# EAGLE schematic power_tower_mast (EAGLE 7.1.0)
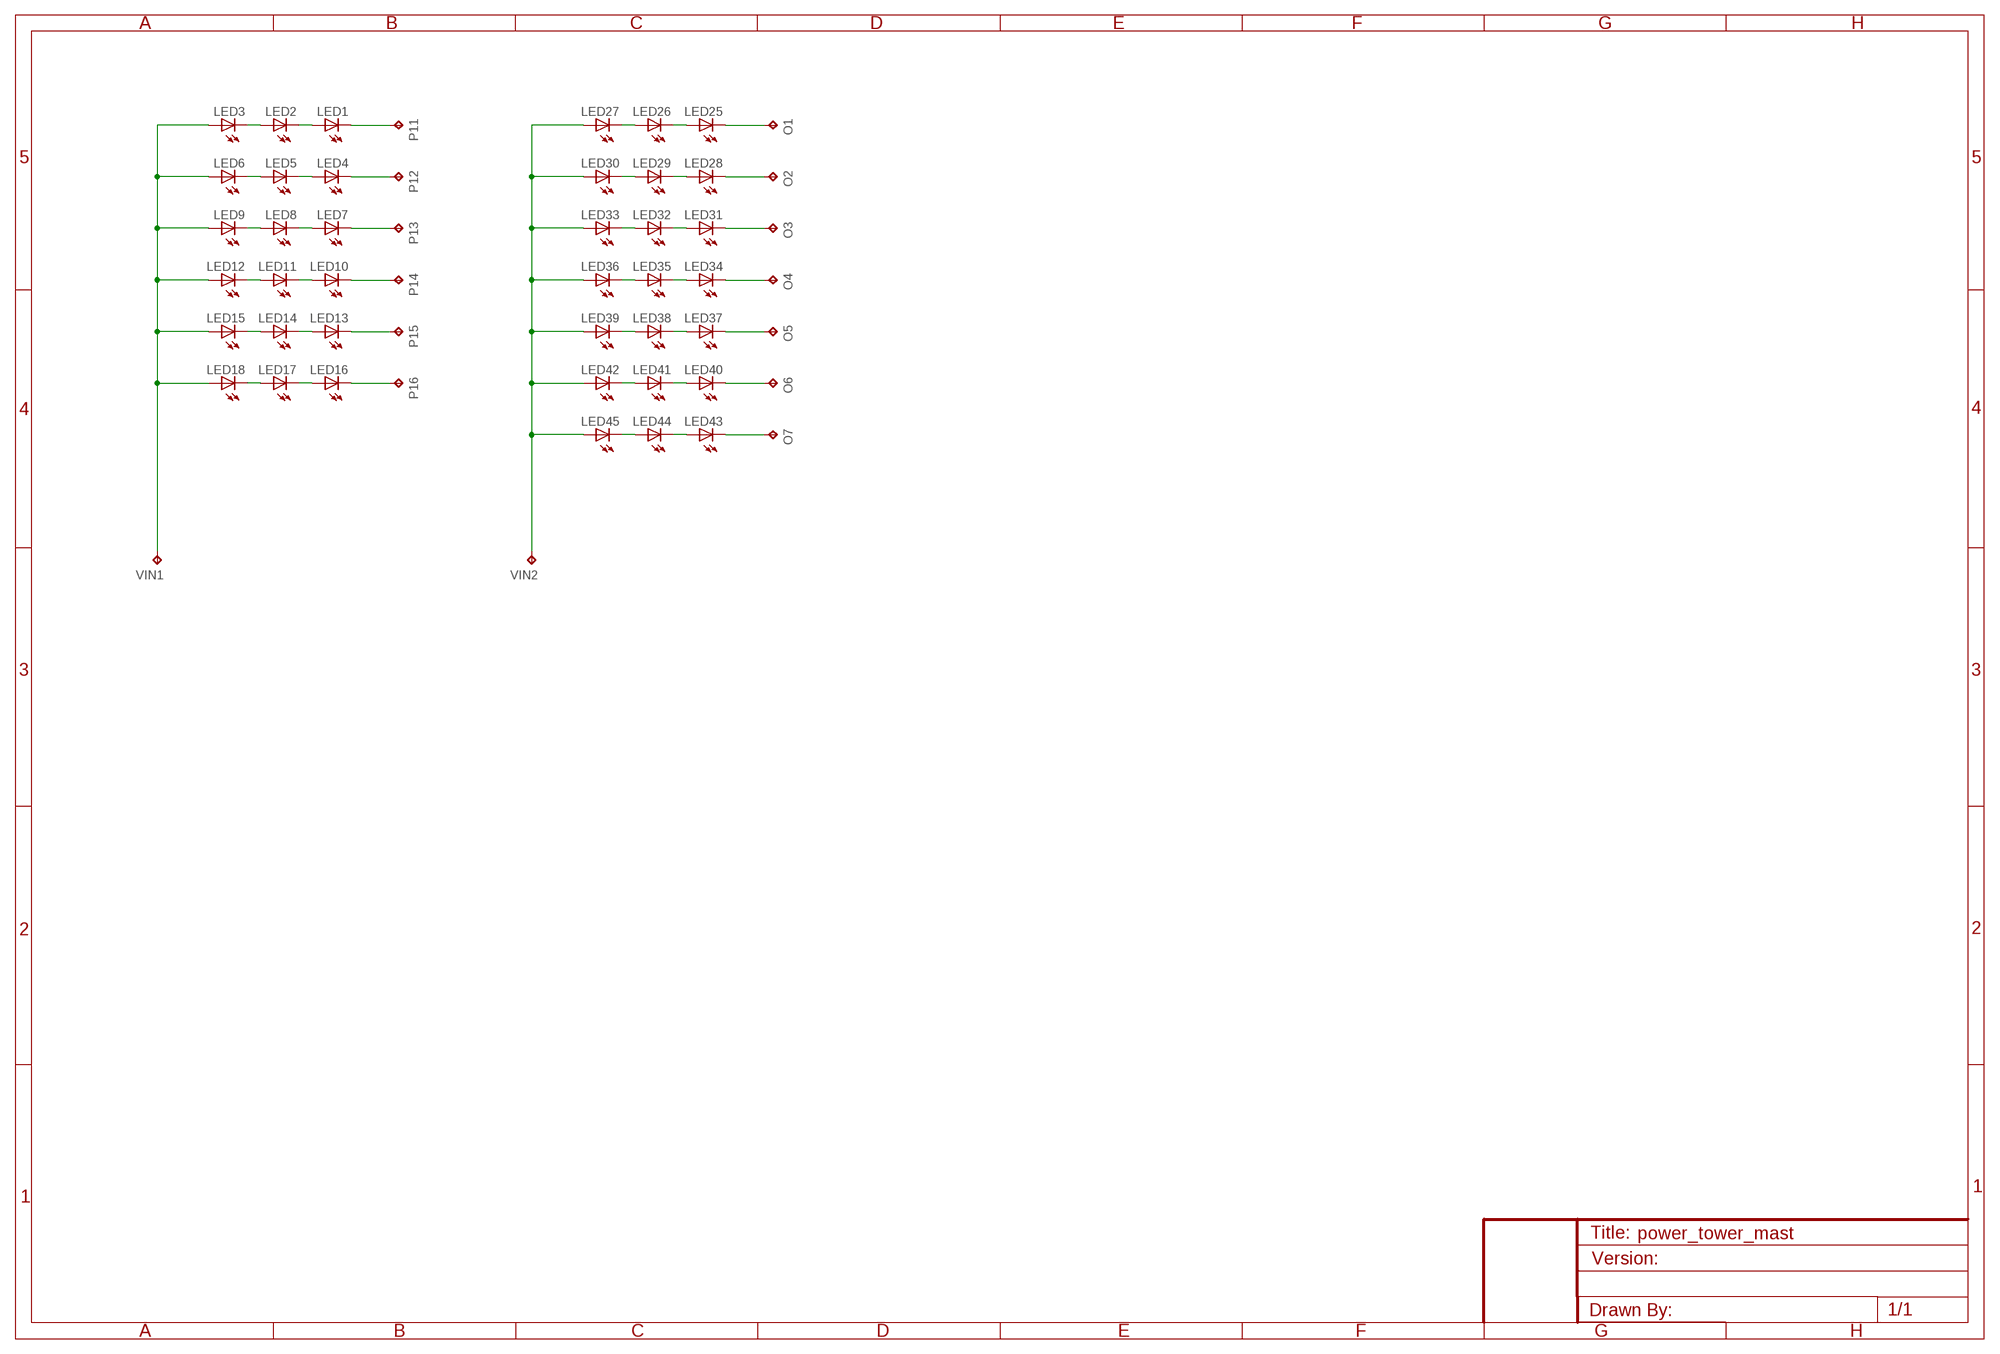
[diagram p0: schematic, sheet 1]

## Parts
LED1  LED0805  [LED_0805]
LED2  LED0805  [LED_0805]
LED3  LED0805  [LED_0805]
LED4  LED0805  [LED_0805]
LED5  LED0805  [LED_0805]
LED6  LED0805  [LED_0805]
LED7  LED0805  [LED_0805]
LED8  LED0805  [LED_0805]
LED9  LED0805  [LED_0805]
LED10  LED0805  [LED_0805]
LED11  LED0805  [LED_0805]
LED12  LED0805  [LED_0805]
LED13  LED0805  [LED_0805]
LED14  LED0805  [LED_0805]
LED15  LED0805  [LED_0805]
LED16  LED0805  [LED_0805]
LED17  LED0805  [LED_0805]
LED18  LED0805  [LED_0805]
LED25  LED0805  [LED_0805]
LED26  LED0805  [LED_0805]
LED27  LED0805  [LED_0805]
LED28  LED0805  [LED_0805]
LED29  LED0805  [LED_0805]
LED30  LED0805  [LED_0805]
LED31  LED0805  [LED_0805]
LED32  LED0805  [LED_0805]
LED33  LED0805  [LED_0805]
LED34  LED0805  [LED_0805]
LED35  LED0805  [LED_0805]
LED36  LED0805  [LED_0805]
LED37  LED0805  [LED_0805]
LED38  LED0805  [LED_0805]
LED39  LED0805  [LED_0805]
LED40  LED0805  [LED_0805]
LED41  LED0805  [LED_0805]
LED42  LED0805  [LED_0805]
LED43  LED0805  [LED_0805]
LED44  LED0805  [LED_0805]
LED45  LED0805  [LED_0805]
O1  TEST_POINTPAD1-20  [P1-20]
O2  TEST_POINTPAD1-20  [P1-20]
O3  TEST_POINTPAD1-20  [P1-20]
O4  TEST_POINTPAD1-20  [P1-20]
O5  TEST_POINTPAD1-20  [P1-20]
O6  TEST_POINTPAD1-20  [P1-20]
O7  TEST_POINTPAD1-20  [P1-20]
P11  TEST_POINTPAD1-20  [P1-20]
P12  TEST_POINTPAD1-20  [P1-20]
P13  TEST_POINTPAD1-20  [P1-20]
P14  TEST_POINTPAD1-20  [P1-20]
P15  TEST_POINTPAD1-20  [P1-20]
P16  TEST_POINTPAD1-20  [P1-20]
VIN1  TEST_POINTPAD1-20  [P1-20]
VIN2  TEST_POINTPAD1-20  [P1-20]

## Nets
N$1: LED1.A LED2.C
N$2: LED2.A LED3.C
N$3: LED25.A LED26.C
N$4: LED26.A LED27.C
N$5: LED4.A LED5.C
N$6: LED5.A LED6.C
N$7: LED28.A LED29.C
N$8: LED29.A LED30.C
N$9: LED7.A LED8.C
N$10: LED8.A LED9.C
N$11: LED31.A LED32.C
N$12: LED32.A LED33.C
N$13: LED10.A LED11.C
N$14: LED11.A LED12.C
N$15: LED34.A LED35.C
N$16: LED35.A LED36.C
N$17: LED13.A LED14.C
N$18: LED14.A LED15.C
N$19: LED37.A LED38.C
N$20: LED38.A LED39.C
N$21: LED16.A LED17.C
N$22: LED17.A LED18.C
N$23: LED40.A LED41.C
N$24: LED41.A LED42.C
N$27: LED43.A LED44.C
N$28: LED44.A LED45.C
VIN: LED3.A LED6.A LED9.A LED12.A LED15.A LED18.A VIN1.TP
VIN1: LED27.A LED30.A LED33.A LED36.A LED39.A LED42.A LED45.A VIN2.TP
VOUT1: LED1.C P11.TP
VOUT2: LED4.C P12.TP
VOUT3: LED7.C P13.TP
VOUT4: LED10.C P14.TP
VOUT5: LED13.C P15.TP
VOUT6: LED16.C P16.TP
VOUT9: LED25.C O1.TP
VOUT10: LED28.C O2.TP
VOUT11: LED31.C O3.TP
VOUT12: LED34.C O4.TP
VOUT13: LED37.C O5.TP
VOUT14: LED40.C O6.TP
VOUT15: LED43.C O7.TP

## Library data of the parts
LED1-LED18 LED25-LED45 = CyberRailGuru:LED: LEDs Standard schematic elements and footprints for 5mm, 3mm, 1206, and 0603 sized LEDs. 5mm - Spark Fun Electronics SKU : COM-00529 (and others)
O1-O7 P11-P16 VIN1 VIN2 = CyberRailGuru:TEST_POINT: Test pad